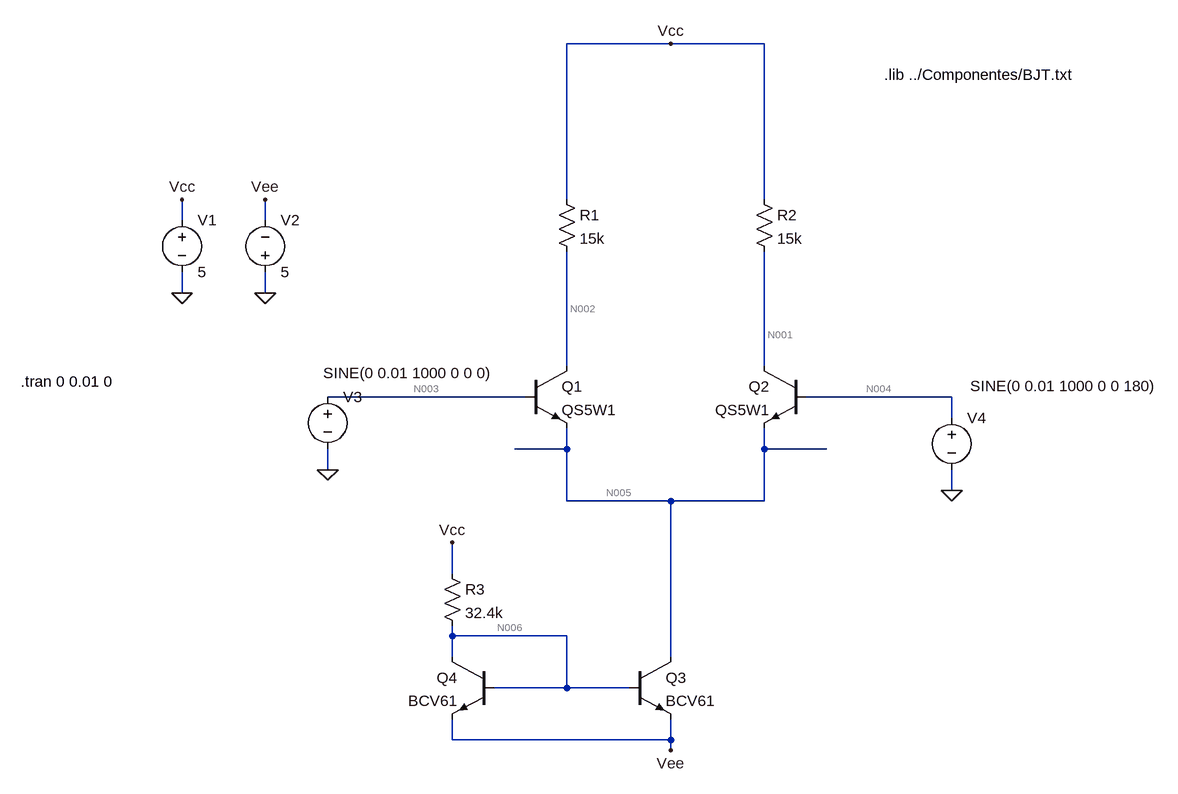
[diagram p0: schematic simulacion.asc]
simulacion.asc, the LTspice schematic file:
Version 4
SHEET 1 1252 828
WIRE 112 -352 -48 -352
WIRE 256 -352 112 -352
WIRE 256 -240 256 -352
WIRE -48 -112 -48 -352
WIRE 256 -112 256 -240
WIRE -640 -80 -640 -112
WIRE -512 -80 -512 -112
WIRE -640 32 -640 0
WIRE -512 32 -512 0
WIRE 256 48 256 -32
WIRE -48 144 -48 -32
WIRE 256 144 256 48
WIRE -112 192 -416 192
WIRE 544 192 320 192
WIRE 544 224 544 192
WIRE -48 272 -48 240
WIRE -48 272 -128 272
WIRE 256 272 256 240
WIRE 352 272 256 272
WIRE -416 304 -416 272
WIRE 544 336 544 304
WIRE -48 352 -48 272
WIRE 112 352 -48 352
WIRE 256 352 256 272
WIRE 256 352 112 352
WIRE -224 464 -224 416
WIRE 112 512 112 352
WIRE -224 560 -224 544
WIRE -48 560 -224 560
WIRE -224 592 -224 560
WIRE 112 592 112 512
WIRE -48 640 -48 560
WIRE -48 640 -160 640
WIRE 48 640 -48 640
WIRE -224 720 -224 688
WIRE 112 720 112 688
WIRE 112 720 -224 720
WIRE 112 736 112 720
FLAG -640 32 0
FLAG -512 32 0
FLAG -640 -112 Vcc
FLAG -512 -112 Vee
FLAG 112 -352 Vcc
FLAG 544 336 0
FLAG -416 304 0
FLAG 112 736 Vee
FLAG -224 416 Vcc
DATAFLAG -128 272 ""
DATAFLAG 352 272 ""
DATAFLAG 16 384 "Ie(Q1)"
DATAFLAG 208 384 "Ie(Q2)"
DATAFLAG 112 512 "Ic(Q3)"
DATAFLAG 256 48 ""
DATAFLAG 256 -240 "I(R2)"
SYMBOL npn -112 144 R0
SYMATTR InstName Q1
SYMATTR Value QS5W1
SYMBOL npn 320 144 M0
SYMATTR InstName Q2
SYMATTR Value QS5W1
SYMBOL voltage -640 -96 R0
WINDOW 123 0 0 Left 2
WINDOW 39 0 0 Left 2
SYMATTR InstName V1
SYMATTR Value 5
SYMBOL voltage -512 16 M180
WINDOW 0 24 96 Left 2
WINDOW 3 24 16 Left 2
WINDOW 123 0 0 Left 2
WINDOW 39 0 0 Left 2
SYMATTR InstName V2
SYMATTR Value 5
SYMBOL voltage -416 176 R0
WINDOW 3 -7 -21 Left 2
WINDOW 123 0 0 Left 2
WINDOW 39 0 0 Left 2
SYMATTR Value SINE(0 0.01 1000 0 0 0)
SYMATTR InstName V3
SYMBOL voltage 544 208 R0
WINDOW 3 29 -33 Left 2
WINDOW 123 0 0 Left 2
WINDOW 39 0 0 Left 2
SYMATTR Value SINE(0 0.01 1000 0 0 180)
SYMATTR InstName V4
SYMBOL npn 48 592 R0
SYMATTR InstName Q3
SYMATTR Value BCV61
SYMBOL npn -160 592 M0
SYMATTR InstName Q4
SYMATTR Value BCV61
SYMBOL res -64 -128 R0
SYMATTR InstName R1
SYMATTR Value 15k
SYMBOL res 240 -128 R0
SYMATTR InstName R2
SYMATTR Value 15k
SYMBOL res -240 448 R0
SYMATTR InstName R3
SYMATTR Value 32.4k
TEXT 440 -304 Left 2 !.lib ../Componentes/BJT.txt
TEXT -888 168 Left 2 !.tran 0 0.01 0

The netlist it stands for:
* simulacion.asc
Q1 N002 N003 N005 0 QS5W1
Q2 N001 N004 N005 0 QS5W1
V1 Vcc 0 5
V2 0 Vee 5
V3 N003 0 SINE(0 0.01 1000 0 0 0)
V4 N004 0 SINE(0 0.01 1000 0 0 180)
Q3 N005 N006 Vee 0 BCV61
Q4 N006 N006 Vee 0 BCV61
R1 Vcc N002 15k
R2 Vcc N001 15k
R3 Vcc N006 32.4k
.model NPN NPN
.model PNP PNP
.lib standard.bjt
.lib ../Componentes/BJT.txt
.tran 0 0.01 0
.backanno
.end

* Results of the author's LTspice run, read from the files saved beside the schematic
* Operating Point, zero values left out:
*   V(n002) = 2.741 V
*   V(n005) = -504.2 mV
*   V(n001) = 2.741 V
*   V(vcc) = 5 V
*   V(vee) = -5 V
*   V(n006) = -4.396 V
*   Ic(Q4) = 288.1 µA
*   Ib(Q4) = 926.9 nA
*   Ie(Q4) = -289.1 µA
*   Ic(Q3) = 302.2 µA
*   Ib(Q3) = 926.5 nA
*   Ie(Q3) = -303.1 µA
*   Ic(Q2) = 150.6 µA
*   Ib(Q2) = 482.7 nA
*   Ie(Q2) = -151.1 µA
*   Ic(Q1) = 150.6 µA
*   Ib(Q1) = 482.7 nA
*   Ie(Q1) = -151.1 µA
*   I(R3) = 290 µA
*   I(R2) = 150.6 µA
*   I(R1) = 150.6 µA
*   I(V4) = -482.7 nA
*   I(V3) = -482.7 nA
*   I(V2) = -592.2 µA
*   I(V1) = -591.2 µA
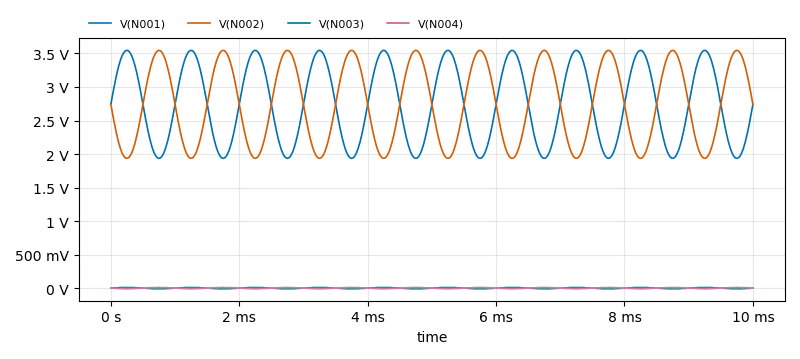
[diagram p1: Transient Analysis of simulacion.asc, plotted from the saved traces]
* Transient Analysis, 1 run:
*   V(N001): min 1.936 V, max 3.546 V, average 2.741 V, rms 2.801 V, last 2.739 V
*   V(N002): min 1.935 V, max 3.546 V, average 2.741 V, rms 2.801 V, last 2.743 V
*   V(N003): min -9.99 mV, max 9.99 mV, average -135 nV, rms 7.076 mV, last 0 V
*   V(N004): min -9.99 mV, max 9.99 mV, average 135 nV, rms 7.076 mV, last 0 V